# Altium project shm.PrjPcb (part 1 of 2)
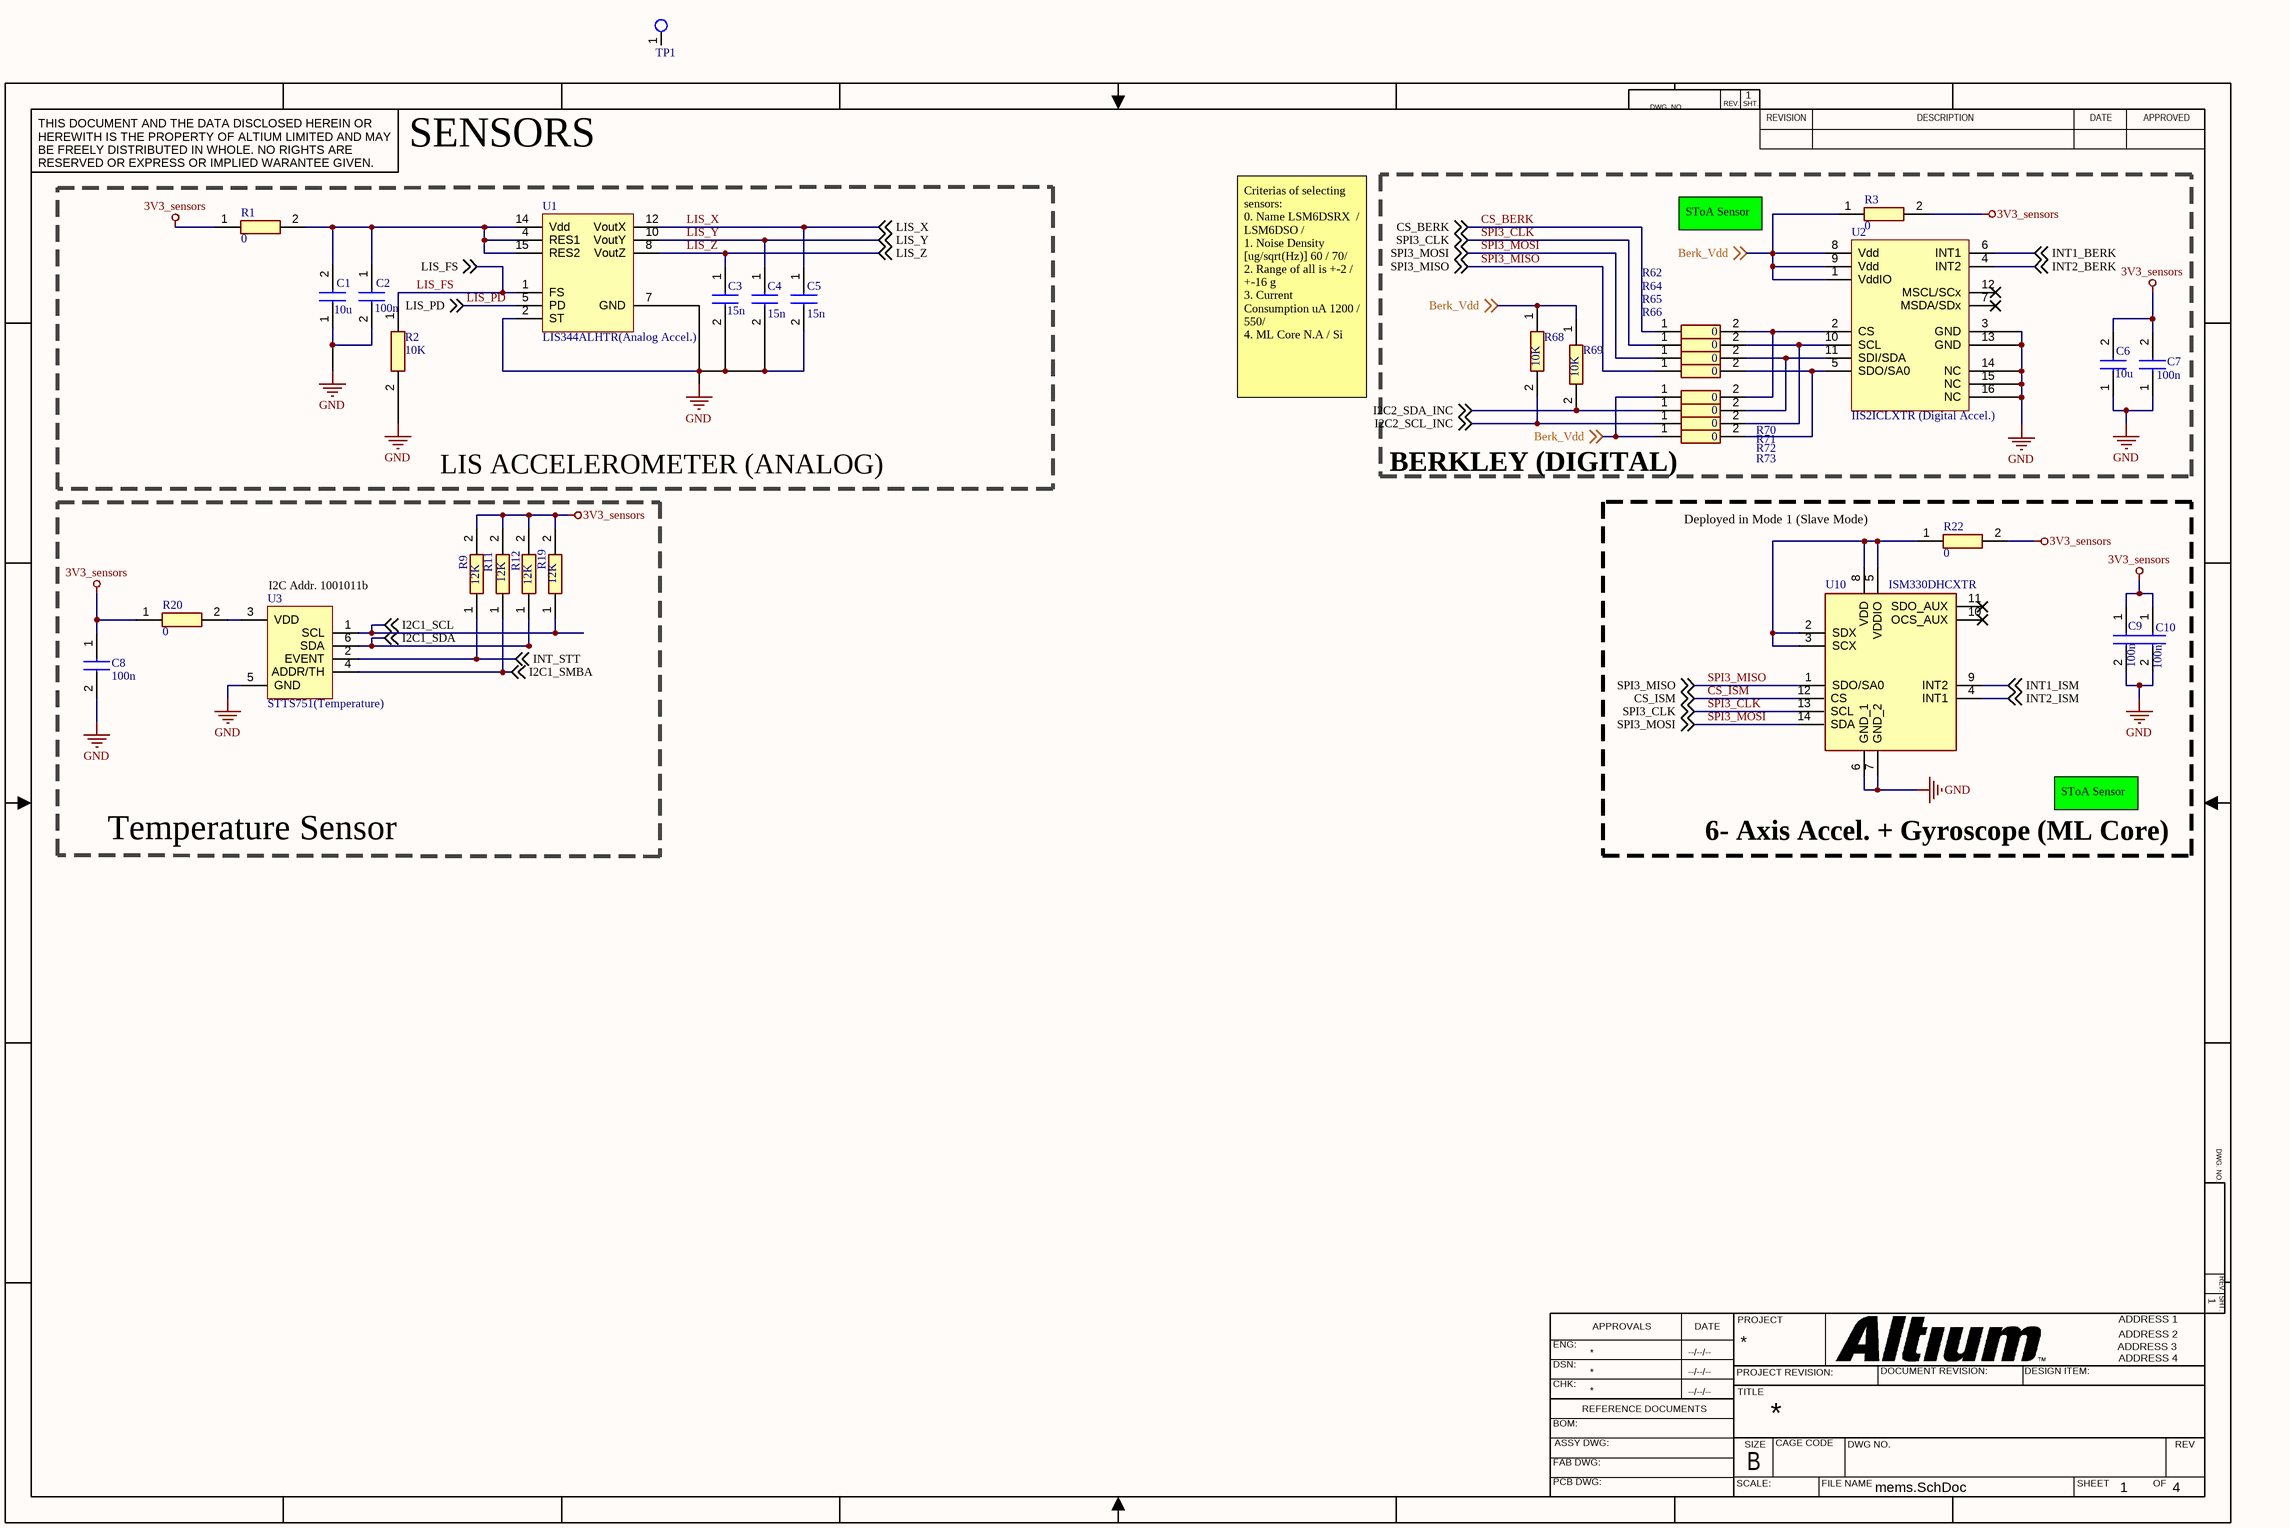
[diagram p0: mems.SchDoc]
4 sheets, 183 parts. Net scope: flat (ports and power ports of the same name join across sheets).
Board file: shm_pcb.PcbDoc
Sheets:
  mems.SchDoc
  connectors.SchDoc
  new power management.SchDoc
  mcu_v1.SchDoc

## Sheet mems.SchDoc
size 431 x 279 mm; Organization: ORGANIZATION; Address1: ADDRESS 1; Address2: ADDRESS 2; Address3: ADDRESS 3; Address4: ADDRESS 4; Revision: -; SheetNumber: 1; SheetTotal: 4; ENG_APP_DATE: --/--/--; DSN_APP_DATE: --/--/--; CHK_APP_DATE: --/--/--

### Parts
C1  10u  [CAPC1608X100N]
C2  100n  [CAPC1608X87N]
C3  15n  [CAPC1608X87N]
C4  15n  [CAPC1608X87N]
C5  15n  [CAPC1608X87N]
C6  10u  [CAPC1608X100N]
C7  100n  [CAPC1608X87N]
C8  100n  [CAPC1608X87N]
C9  100n  [CAPC1608X87N]
C10  100n  [CAPC1608X87N]
R1  0  [RESC1608X55N]
R2  10K  [ERJ3EK_(0603)]
R3  0  [RESC1608X55N]
R9  12K  [RESC0603X26N]
R11  12K  [RESC0603X26N]
R12  12K  [RESC0603X26N]
R19  12K  [RESC0603X26N]
R20  0  [RESC1608X55N]
R22  0  [RESC1608X55N]
R62  0  [RESC1608X55N]
R64  0  [RESC1608X55N]
R65  0  [RESC1608X55N]
R66  0  [RESC1608X55N]
R68  10K  [ERJ3EK_(0603)]
R69  10K  [ERJ3EK_(0603)]
R70  0  [RESC1608X55N]
R71  0  [RESC1608X55N]
R72  0  [RESC1608X55N]
R73  0  [RESC1608X55N]
TP1  test_point  [test_point]  (value not drawn)  (no BOM)
U1  LIS344ALHTR(Analog Accel.)  [LGA16R65P4X4_400X400X160]
U2  IIS2ICLXTR (Digital Accel.)  [Berkley]
U3  STTS751(Temperature)  [SOT95P280X145-6N]
U10  ISM330DHCXTR  [LGA-14(2.5X3X0.86)]

### Blocks framed on the sheet
LIS ACCELEROMETER (ANALOG): C1-C5 R1 R2 U1
BERKLEY (DIGITAL): C6 C7 R3 R62 R64-R66 R68-R73 U2
Temperature Sensor: C8 R9 R11 R12 R19 R20 U3
6- Axis Accel. + Gyroscope (ML Core): C9 C10 R22 U10

### Nets
3V3_sensors: C6.2 C7.2 C8.1 C9.1 C10.1 R1.1 R3.2 R9.2 R11.2 R12.2 R19.2 R20.1 R22.2
GND: C1.1 C2.2 C3.2 C4.2 C5.2 C6.1 C7.1 C8.2 C9.2 C10.2 R2.2 U1.2(ST) U1.7(GND) U2.3(GND) U2.13(GND) U2.14(NC) U2.15(NC) U2.16(NC) U3.5(GND) U10.6(GND_1) U10.7(GND_2)
Berk_Vdd: R3.1 R68.1 R69.1 R70.1 R73.1 U2.1(VddIO) U2.8(Vdd) U2.9(Vdd) ; off-sheet Berk_Vdd
CS_BERK: R62.1 ; off-sheet CS_BERK
CS_ISM: U10.12(CS) ; off-sheet CS_ISM
I2C1_SCL: R19.1 U3.1(SCL) ; off-sheet I2C1_SCL
I2C1_SDA: R12.1 U3.6(SDA) ; off-sheet I2C1_SDA
I2C1_SMBA: R11.1 U3.4(ADDR/TH) ; off-sheet I2C1_SMBA
I2C2_SCL_INC: R68.2 R72.1 ; off-sheet I2C2_SCL_INC
I2C2_SDA_INC: R69.2 R71.1 ; off-sheet I2C2_SDA_INC
INT1_BERK: U2.6(INT1) ; off-sheet INT1_BERK
INT1_ISM: U10.9(INT2) ; off-sheet INT1_ISM
INT2_BERK: U2.4(INT2) ; off-sheet INT2_BERK
INT2_ISM: U10.4(INT1) ; off-sheet INT2_ISM
INT_STT: R9.1 U3.2(EVENT) ; off-sheet INT_STT
LIS_FS: R2.1 U1.1(FS) ; off-sheet LIS_FS
LIS_PD: U1.5(PD) ; off-sheet LIS_PD
LIS_X: C5.1 U1.12(VoutX) ; off-sheet LIS_X
LIS_Y: C4.1 U1.10(VoutY) ; off-sheet LIS_Y
LIS_Z: C3.1 U1.8(VoutZ) ; off-sheet LIS_Z
SPI3_CLK: R64.1 U10.13(SCL) ; off-sheet SPI3_CLK
SPI3_MISO: R66.1 U10.1(SDO/SA0) ; off-sheet SPI3_MISO
SPI3_MOSI: R65.1 U10.14(SDA) ; off-sheet SPI3_MOSI
NetC1_2: C1.2 C2.1 R1.2 U1.4(RES1) U1.14(Vdd) U1.15(RES2)
NetR20_2: R20.2 U3.3(VDD)
NetR22_1: R22.1 U10.2(SDX) U10.3(SCX) U10.5(VDDIO) U10.8(VDD)
NetR62_2: R62.2 R70.2 U2.2(CS)
NetR64_2: R64.2 R72.2 U2.10(SCL)
NetR65_2: R65.2 R71.2 U2.11(SDI/SDA)
NetR66_2: R66.2 R73.2 U2.5(SDO/SA0)

Not connected (* = marked no-connect by the designer): TP1 1(TP); U2 7(MSDA/SDx)* 12(MSCL/SCx)*; U10 10(OCS_AUX)* 11(SDO_AUX)*

### Notes on the sheet
- SENSORS
- SToA Sensor
- Criterias of selecting sensors:
  0. Name LSM6DSRX  / LSM6DSO /
  1. Noise Density [ug/sqrt(Hz)] 60 / 70/
  2. Range of all is +-2 / +-16 g
  3. Current Consumption uA 1200 / 550/
  4. ML Core N.A / Si
- Deployed in Mode 1 (Slave Mode)
- (near U3) I2C Addr. 1001011b
- It is an event detection pin. It will trigger to 0 when temperature is below or equal to low level threshold or higher than an upper boundary.
- This pin has 2 tasks:
  1. Define the address of the I2C slave for the sensor. Sensor's address is based on the pull-up resistor indicated in Table 1 of datasheet. If it is connected to GND, address would be 76h (111 0110b).
  2. Drops to zero when temperature exceeds the THerm limit in register 20h. This pin can either be connected to an MCU (an external interrupt), or to an external Fan to cool down the system.
- DWG. NO.
- REV.
- SHT.
- THIS DOCUMENT AND THE DATA DISCLOSED HEREIN OR HEREWITH IS THE PROPERTY OF ALTIUM LIMITED AND MAY BE FREELY DISTRIBUTED IN WHOLE. NO RIGHTS ARE RESERVED OR EXPRESS OR IMPLIED WARANTEE GIVEN.
- REVISION
- DESCRIPTION
- DATE
- APPROVED
- ENG:
- APPROVALS
- PROJECT
- DSN:
- CHK:
- REFERENCE DOCUMENTS
- PROJECT REVISION:
- TITLE
- DOCUMENT REVISION:
- DESIGN ITEM:
- BOM:
- FAB DWG:
- PCB DWG:
- ASSY DWG:
- SCALE:
- SIZE
- B
- CAGE CODE
- FILE NAME
- DWG NO.
- SHEET
- OF
- REV

### Library data of the parts
C1 C6 = LMK107BBJ106KALT: Capacitor; Manufacturer_Name: TAIYO YUDEN; Datasheet Link: https://componentsearchengine.com//LMK107BBJ106KALT.pdf; Height: 1mm; Mouser2 Part Number: 963-LMK107BBJ106KALT; Mouser2 Price/Stock: https://www.mouser.com/Search/Refine.aspx?Keyword=963-LMK107BBJ106KALT; Manufacturer_Part_Number: LMK107BBJ106KALT
C2 C7-C10 = 885012206071: Capacitor; Manufacturer_Name: Wurth Elektronik; Datasheet Link: https://katalog.we-online.com/pbs/datasheet/885012206071.pdf; Height: 0.87mm; Manufacturer_Part_Number: 885012206071
C3-C5 = 885012206041: Capacitor; Manufacturer_Name: Wurth Elektronik; Datasheet Link: https://katalog.we-online.com/pbs/datasheet/885012206041.pdf; Height: 0.87mm; Manufacturer_Part_Number: 885012206041
R1 R3 R20 R22 R62 R64-R66 R70-R73 = RC0603FR-070RL: Resistor; Manufacturer_Name: YAGEO (PHYCOMP); Height: 0.55mm; Manufacturer_Part_Number: RC0603FR-070RL
R2 R68 R69 = ERJ-3EKF1002V: Resistor; Manufacturer_Name: Panasonic; Datasheet Link: https://componentsearchengine.com//ERJ-3EKF1002V.pdf; Height: 0.55mm; Mouser2 Part Number: 667-ERJ-3EKF1002V; Mouser2 Price/Stock: https://www.mouser.com/Search/Refine.aspx?Keyword=667-ERJ-3EKF1002V; Manufacturer_Part_Number: ERJ-3EKF1002V
R9 R11 R12 R19 = ERJ-1RHD1202C: Resistor; Manufacturer_Name: Panasonic; Datasheet Link: https://industrial.panasonic.com/cdbs/www-data/pdf/RDA0000/AOA0000C304.pdf; Height: 0.26mm; Manufacturer_Part_Number: ERJ-1RHD1202C
U1 = LIS344ALHTR: 3-axis analog accelerometer, ±2 g / ±6 g user selectable full-scale, ultra compact, low power; Manufacturer: STMicroelectronics; Max Supply Voltage: 3.6V; Min Supply Voltage: 2.4V; Nominal Supply Current: 680uA; Bandwidth: 2kHz; Sensitivity: 15000mV/g; Axis: X, Y, Z; Supplier 1: Digi-Key; Manufacturer Part Number: LIS344ALHTR; RoHS: Yes; Stock 1: 153; Mount: Surface Mount; Case/Package: LGA; Number of Pins: 16; Contact Plating: Gold; Min Operating Temperature: -40°C; Max Operating Temperature: 85°C; Packaging: Tape and Reel; Package Quantity: 1; Output Type: Analog; Length: 4.15mm; Width: 4.15mm; Height: 1.33mm; Radiation Hardening: No; Lead Free: Lead Free; ComponentLink1URL: https://datasheet.ciiva.com/12174/cd00182781-85334-12174772.pdf?src-supplier=Mouser; ComponentLink1Description: https://datasheet.ciiva.com/12174/cd00182781-85334-12174772.pdf?src-supplier=Mouser; ComponentLink2URL: https://datasheet.ciiva.com/26928/lis344alhtr-26928753.pdf?src-supplier=IIIC; ComponentLink2Description: https://datasheet.ciiva.com/26928/lis344alhtr-26928753.pdf?src-supplier=IIIC; ComponentLink3URL: https://datasheet.ciiva.com/2809/cd00182781-2809847.pdf?src-supplier=Digi-Key; ComponentLink3Description: https://datasheet.ciiva.com/2809/cd00182781-2809847.pdf?src-supplier=Digi-Key; ComponentLink4URL: https://datasheet.ciiva.com/16372/cd00182781-16372423.pdf?src-supplier=Future+Electronics; ComponentLink4Description: https://datasheet.ciiva.com/16372/cd00182781-16372423.pdf?src-supplier=Future+Electronics; ComponentLink5URL: https://datasheet.ciiva.com/2809/cd00182781-2809848.pdf?src-supplier=Digi-Key; ComponentLink5Description: https://datasheet.ciiva.com/2809/cd00182781-2809848.pdf?src-supplier=Digi-Key; ComponentLink6URL: https://datasheet.ciiva.com/2809/cd00182781-2809849.pdf?src-supplier=Digi-Key; ComponentLink6Description: https://datasheet.ciiva.com/2809/cd00182781-2809849.pdf?src-supplier=Digi-Key; ComponentLink7URL: https://datasheet.ciiva.com/16638/cd00182781-16638187.pdf?src-supplier=Avnet+Europe; ComponentLink7Description: https://datasheet.ciiva.com/16638/cd00182781-16638187.pdf?src-supplier=Avnet+Europe; Supplier Part Number 1: 497-6345-1-ND; Category: Sensors
U2 = IIS2ICLXTR: High-accuracy, high-resolution, low-power, 2- axis digital inclinometer; Manufacturer: STMicroelectronics; Supplier 1: Digi-Key; Supplier Part Number 1: 497-IIS2ICLXCT-ND; Manufacturer Part Number: IIS2ICLXTR; RoHS: Yes; Category: Accelerometers; Stock 1: 25
U3 = STTS751-1DP3F: SENSOR TEMPERATURE SMBUS 6UDFN; Manufacturer: STMicroelectronics; Interface: I2C,SMBus,2-Wire,Serial; Resolution: 12b; Output Type: Digital; Max Output Current: 20mA; Min Supply Voltage: 2.25V; Max Supply Voltage: 3.6V; Min Supply Voltage (DC): 2V; Operating Supply Current: 50uA; Supplier 1: RSComponents; Supplier Part Number 1: 1908454; Manufacturer Part Number: STTS751-1DP3F; RoHS: Yes; Category: Sensors; Stock 1: 1; Mount: Surface Mount; Number of Pins: 6; Min Operating Temperature: -40°C; Max Operating Temperature: 125°C; Package Quantity: 3000; Packaging: Tape and Reel; Output Current: 20mA; Max Supply Voltage (DC): 3.6V; Series: STTS751; Radiation Hardening: No; Lead Free: Lead Free; RoHS Compliant: Yes; ComponentLink1URL: https://datasheet.ciiva.com/5299/cd00252523-68863-5299731.pdf?src-supplier=Mouser; ComponentLink1Description: https://datasheet.ciiva.com/5299/cd00252523-68863-5299731.pdf?src-supplier=Mouser; ComponentLink2URL: https://datasheet.ciiva.com/2003/cd00252523-2003053.pdf?src-supplier=Digi-Key; ComponentLink2Description: https://datasheet.ciiva.com/2003/cd00252523-2003053.pdf?src-supplier=Digi-Key; ComponentLink3URL: https://datasheet.ciiva.com/2003/cd00252523-2003054.pdf?src-supplier=Digi-Key; ComponentLink3Description: https://datasheet.ciiva.com/2003/cd00252523-2003054.pdf?src-supplier=Digi-Key; ComponentLink4URL: https://datasheet.ciiva.com/16635/cd00252523-16635462.pdf?src-supplier=Avnet+Europe; ComponentLink4Description: https://datasheet.ciiva.com/16635/cd00252523-16635462.pdf?src-supplier=Avnet+Europe; ComponentLink5URL: https://datasheet.ciiva.com/2003/cd00252523-2003052.pdf?src-supplier=Digi-Key; ComponentLink5Description: https://datasheet.ciiva.com/2003/cd00252523-2003052.pdf?src-supplier=Digi-Key
U10 = ISM330DHCXTR: iNEMO inertial Sensor include 3D accelerometer & 3D gyroscope; LGA-14L package; Manufacturer: STMicroelectronics; Supplier 1: Digi-Key; Supplier Part Number 1: 497-19784-1-ND; Manufacturer Part Number: ISM330DHCXTR; RoHS: Yes; Category: Inertial Measurement Units (IMUs); Stock 1: 9794

## Sheet connectors.SchDoc
size 431 x 279 mm; SheetNumber: 2; SheetTotal: 4
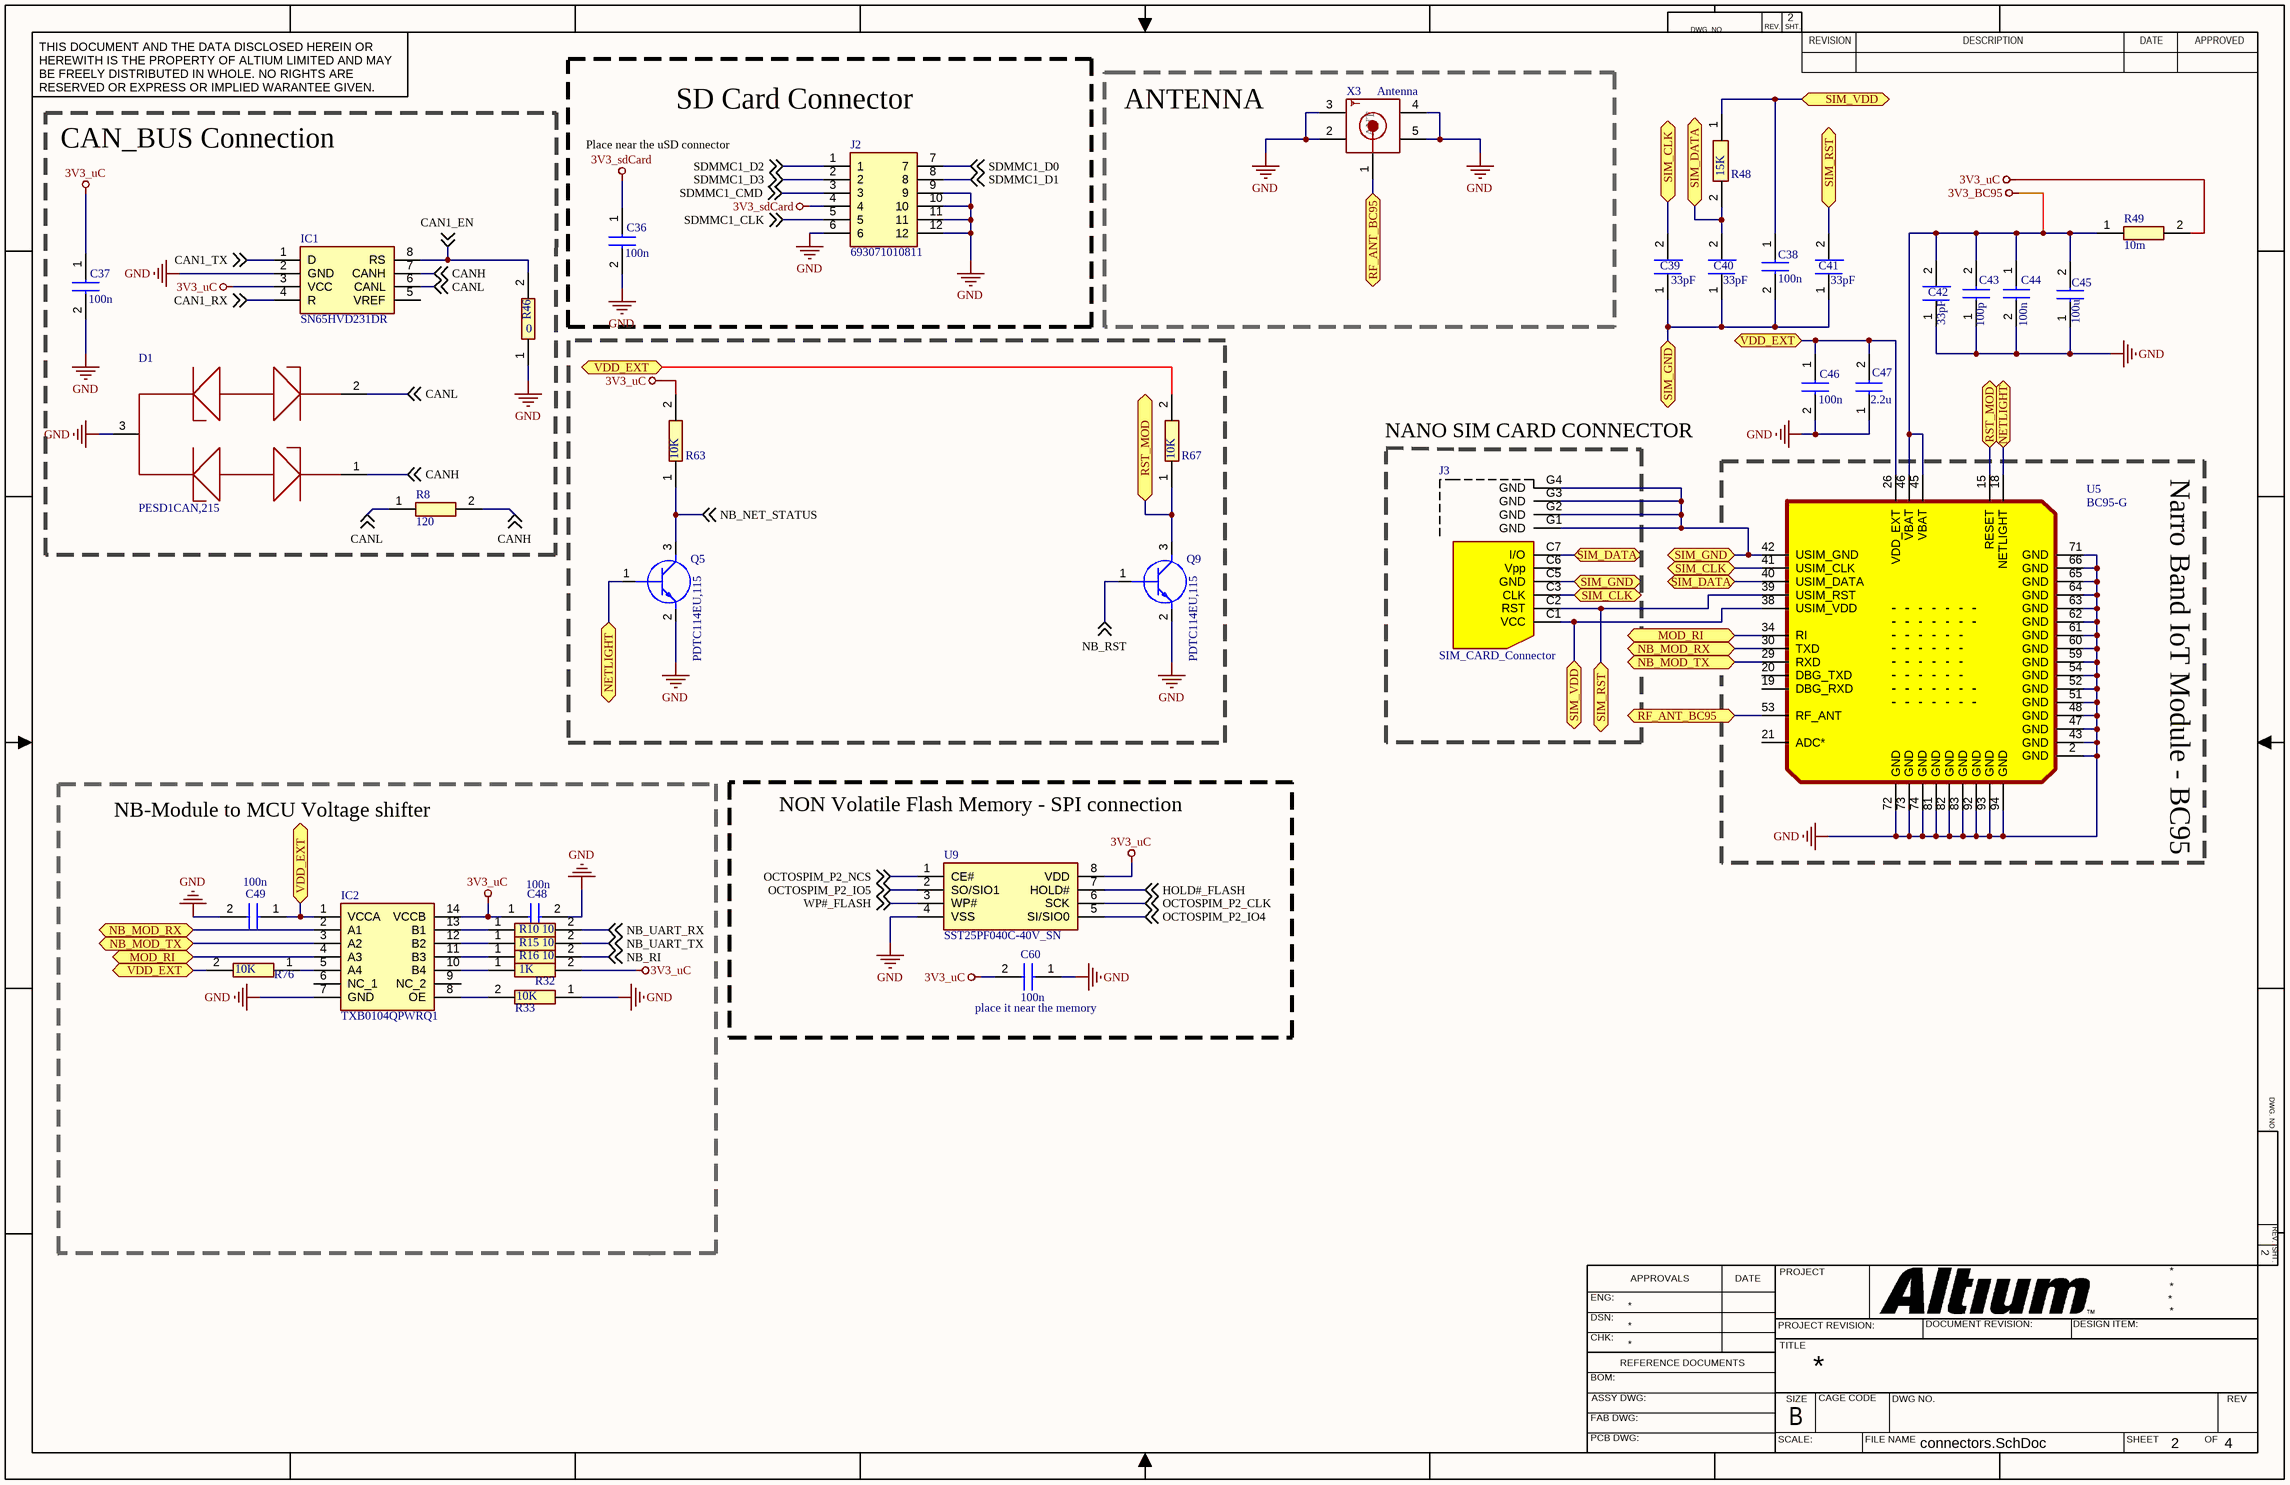
[diagram p1: connectors.SchDoc]

### Parts
C36  100n  [CAPC1608X87N]
C37  100n  [CAPC1608X87N]
C38  100n  [CAPC1608X87N]
C39  33pF  [CAPC1608X87N]
C40  33pF  [CAPC1608X87N]
C41  33pF  [CAPC1608X87N]
C42  33pF  [CAPC1608X87N]
C43  100p  [CAPC1608X87N]
C44  100n  [CAPC1608X87N]
C45  100u  [CAPC3216X180N]
C46  100n  [CAPC1608X87N]
C47  2.2u  [CAPC1608X50N]
C48  100n  [CAPC1608X87N]
C49  100n  [CAPC1608X87N]
C60  100n  [CAPC1608X87N]
D1  PESD1CAN,215  [SOT95P230X110-3N]
IC1  SN65HVD231DR  [SOIC127P600X175-8N]
IC2  TXB0104QPWRQ1  [SOP65P640X120-14N]
J2  693071010811  [693071010811]
J3  SIM_CARD_Connector  [SIM8060601400A]
Q5  PDTC114EU,115  [SOT65P210X110-3N]
Q9  PDTC114EU,115  [SOT65P210X110-3N]
R8  120  [ERA2V_(0402)]
R10  10  [RESC1005X40N]
R15  10  [RESC1005X40N]
R16  10  [RESC1005X40N]
R32  1K  [RESC1608X55N]
R33  10K  [ERJ3EK_(0603)]
R46  0  [RESC1608X55N]
R48  15K  [RESC1508X50N]
R49  10m  [ERJ6_B_BW_R_LW_CW_D]
R63  10K  [ERJ3EK_(0603)]
R67  10K  [ERJ3EK_(0603)]
R76  10K  [ERJ3EK_(0603)]
U5  BC95-G  [XCVR_BC95GJB02STD]
U9  SST25PF040C-40V_SN  [SOIC127P600X175-8N]
X3  Antenna  [PCBSMAFRAHT]

### Blocks framed on the sheet
CAN_BUS Connection: C37 D1 IC1 R8 R46
SD Card Connector: C36 J2
ANTENNA: X3
NB-Module to MCU Voltage shifter: C48 C49 IC2 R10 R15 R16 R32 R33 R76
NON Volatile Flash Memory - SPI connection: C60 U9

### Ports
MOD_RI (bidir), NB_MOD_RX (bidir), NB_MOD_TX (bidir), NETLIGHT (bidir), RF_ANT_BC95 (bidir), RST_MOD (bidir), SIM_CLK (bidir), SIM_DATA (bidir), SIM_GND (bidir), SIM_RST (bidir), SIM_VDD (bidir), VDD_EXT (bidir)

### Nets
3V3_BC95: C42.2 C43.2 C44.1 C45.2 R49.1 U5.45(VBAT) U5.46(VBAT)
3V3_sdCard: C36.1 J2.4
3V3_uC: C37.1 C48.1 C60.2 IC1.3(VCC) IC2.14(VCCB) R32.2 R49.2 R63.2 U9.8(VDD)
GND: C36.2 C37.2 C42.1 C43.1 C44.2 C45.1 C46.2 C47.1 C48.2 C49.2 C60.1 D1.3 IC1.2(GND) IC2.7(GND) J2.6 J2.9 J2.10 J2.11 J2.12 Q5.2(E) Q9.2(E) R33.1 R46.1 U5.2(GND) U5.43(GND) U5.47(GND) U5.48(GND) U5.51(GND) U5.52(GND) U5.54(GND) U5.59(GND) U5.60(GND) U5.61(GND) U5.62(GND) U5.63(GND) U5.64(GND) U5.65(GND) U5.66(GND) U5.71(GND) U5.72(GND) U5.73(GND) U5.74(GND) U5.81(GND) U5.82(GND) U5.83(GND) U5.92(GND) U5.93(GND) U5.94(GND) U9.4(VSS) X3.2 X3.3 X3.4 X3.5
CAN1_EN: IC1.8(RS) R46.2 ; off-sheet CAN1_EN
CAN1_RX: IC1.4(R) ; off-sheet CAN1_RX
CAN1_TX: IC1.1(D) ; off-sheet CAN1_TX
CANH: D1.1 IC1.7(CANH) R8.2 ; off-sheet CANH
CANL: D1.2 IC1.6(CANL) R8.1 ; off-sheet CANL
HOLD#_FLASH: U9.7(HOLD#) ; off-sheet HOLD#_FLASH
NB_NET_STATUS: Q5.3(C) R63.1 ; off-sheet NB_NET_STATUS
NB_RI: R16.2 ; off-sheet NB_RI
NB_RST: Q9.1(B) ; off-sheet NB_RST
NB_UART_RX: R10.2 ; off-sheet NB_UART_RX
NB_UART_TX: R15.2 ; off-sheet NB_UART_TX
OCTOSPIM_P2_CLK: U9.6(SCK) ; off-sheet OCTOSPIM_P2_CLK
OCTOSPIM_P2_IO4: U9.5(SI/SIO0) ; off-sheet OCTOSPIM_P2_IO4
OCTOSPIM_P2_IO5: U9.2(SO/SIO1) ; off-sheet OCTOSPIM_P2_IO5
OCTOSPIM_P2_NCS: U9.1(CE#) ; off-sheet OCTOSPIM_P2_NCS
SDMMC1_CLK: J2.5 ; off-sheet SDMMC1_CLK
SDMMC1_CMD: J2.3 ; off-sheet SDMMC1_CMD
SDMMC1_D0: J2.7 ; off-sheet SDMMC1_D0
SDMMC1_D1: J2.8 ; off-sheet SDMMC1_D1
SDMMC1_D2: J2.1 ; off-sheet SDMMC1_D2
SDMMC1_D3: J2.2 ; off-sheet SDMMC1_D3
WP#_FLASH: U9.3(WP#) ; off-sheet WP#_FLASH
NetC38_1: C38.1 J3.C1(VCC) R48.1 U5.38(USIM_VDD) ; port SIM_VDD
NetC38_2: C38.2 C39.1 C40.1 C41.1 J3.C5(GND) J3.G1(GND) J3.G2(GND) J3.G3(GND) J3.G4(GND) U5.42(USIM_GND) ; port SIM_GND
NetC39_2: C39.2 J3.C3(CLK) U5.41(USIM_CLK) ; port SIM_CLK
NetC40_2: C40.2 J3.C7(I/O) R48.2 U5.40(USIM_DATA) ; port SIM_DATA
NetC41_2: C41.2 J3.C2(RST) U5.39(USIM_RST) ; port SIM_RST
NetC46_1: C46.1 C47.2 C49.1 IC2.1(VCCA) R67.2 R76.2 U5.26(VDD_EXT) ; port VDD_EXT
NetIC2_2: IC2.2(A1) U5.30(TXD) ; port NB_MOD_RX
NetIC2_3: IC2.3(A2) U5.29(RXD) ; port NB_MOD_TX
NetIC2_4: IC2.4(A3) U5.34(RI) ; port MOD_RI
NetIC2_5: IC2.5(A4) R76.1
NetIC2_8: IC2.8(OE) R33.2
NetIC2_10: IC2.10(B4) R32.1
NetIC2_11: IC2.11(B3) R16.1
NetIC2_12: IC2.12(B2) R15.1
NetIC2_13: IC2.13(B1) R10.1
NetQ5_1: Q5.1(B) U5.18(NETLIGHT) ; port NETLIGHT
NetQ9_3: Q9.3(C) R67.1 U5.15(RESET) ; port RST_MOD
NetU5_53: U5.53(RF_ANT) X3.1 ; port RF_ANT_BC95

Not connected (* = marked no-connect by the designer): IC1 5(VREF); IC2 6(NC_1) 9(NC_2); J3 C6(Vpp); U5 1(RESERVED) 3(RESERVED) 4(RESERVED) 5(RESERVED) 6(RESERVED) 7(RESERVED) 8(RESERVED) 9(RESERVED) 10(RESERVED) 11(RESERVED) 12(RESERVED) 13(RESERVED) 14(RESERVED) 16(RESERVED) 17(RESERVED) 19(DBG_RXD) 20(DBG_TXD) 21(ADC*) 22(RESERVED) 23(RESERVED) 24(RESERVED) 25(RESERVED) 27(RESERVED) 28(RESERVED) 31(RESERVED) 32(RESERVED) 33(RESERVED) 35(RESERVED) 36(RESERVED) 37(RESERVED) 44(RESERVED) 49(RESERVED) 50(RESERVED) 55(RESERVED) 56(RESERVED) 57(RESERVED) 58(RESERVED) 67(RESERVED) 68(RESERVED) 69(RESERVED) 70(RESERVED) 75(RESERVED) 76(RESERVED) 77(RESERVED) 78(RESERVED) 79(RESERVED) 80(RESERVED) 84(RESERVED) 85(RESERVED) 86(RESERVED) 87(RESERVED) 88(RESERVED) 89(RESERVED) 90(RESERVED) 91(RESERVED)

### Notes on the sheet
- Place near the uSD connector
- (near J3) NANO SIM CARD CONNECTOR
- Narro Band IoT Module - BC95
- (near C60) place it near the memory
- DWG. NO.
- REV.
- SHT.
- THIS DOCUMENT AND THE DATA DISCLOSED HEREIN OR HEREWITH IS THE PROPERTY OF ALTIUM LIMITED AND MAY BE FREELY DISTRIBUTED IN WHOLE. NO RIGHTS ARE RESERVED OR EXPRESS OR IMPLIED WARANTEE GIVEN.
- REVISION
- DESCRIPTION
- DATE
- APPROVED
- ENG:
- APPROVALS
- PROJECT
- DSN:
- CHK:
- REFERENCE DOCUMENTS
- PROJECT REVISION:
- TITLE
- DOCUMENT REVISION:
- DESIGN ITEM:
- BOM:
- FAB DWG:
- PCB DWG:
- ASSY DWG:
- SCALE:
- SIZE
- B
- CAGE CODE
- FILE NAME
- DWG NO.
- SHEET
- OF
- REV
- (in symbol PCB.SMAFRA.HT) ANT

### Library data of the parts
C36-C38 C44 C46 C48 C49 C60 = 885012206071: as C2 on sheet mems; Datasheet Link: https://katalog.we-online.com/pbs/datasheet/885012206071.pdf; Height: 0.87mm; Manufacturer_Part_Number: 885012206071
C39-C42 = VJ0603A330KXXCW1BC: Cap Ceramic 33pF 25V C0G 10% SMD 0603 125°C Paper T/R; Manufacturer: Vishay Vitramon; Dielectric Material: Tantalum; Supplier 1: Mouser; Supplier Part Number 1: 77-VJ0603A330KXXCBC; Manufacturer Part Number: VJ0603A330KXXCW1BC; RoHS: Yes; Category: Ceramic Capacitors; Stock 1: 1121; Mount: Surface Mount; Case/Package: 0603; Case Code (Imperial): 0603; Case Code (Metric): 1608; Min Operating Temperature: -55°C; Max Operating Temperature: 125°C; Capacitance: 33pF; Tolerance: 10%; Package Quantity: 4000; Packaging: Tape and Reel; Dielectric: C0G; Voltage Rating (DC): 25V; Termination: SMD/SMT; Series: VJ W1BC; Construction: Flat; Length: 1.6mm; Width: 0.8mm; Height: 0.95mm; Depth: 0.8mm; Lead Free: Lead Free; RoHS Compliant: Yes; ComponentLink1URL: http://www.mouser.com/ds/2/427/vjw1bcbascomseries-223529.pdf?src-supplier=Mouser; ComponentLink1Description: http://www.mouser.com/ds/2/427/vjw1bcbascomseries-223529.pdf?src-supplier=Mouser; ComponentLink2URL: http://www.vishay.com/docs/28548/vjw1bcbascomseries.pdf?src-supplier=Avnet; ComponentLink2Description: http://www.vishay.com/docs/28548/vjw1bcbascomseries.pdf?src-supplier=Avnet; ComponentLink3URL: https://www.vishay.com/docs/28548/vjw1bcbascomseries.pdf?src-supplier=Digi-Key; ComponentLink3Description: https://www.vishay.com/docs/28548/vjw1bcbascomseries.pdf?src-supplier=Digi-Key
C43 = 885012206003: Capacitor; Manufacturer_Name: Wurth Elektronik; Datasheet Link: https://katalog.we-online.com/pbs/datasheet/885012206003.pdf; Height: 0.87mm; Manufacturer_Part_Number: 885012206003
C45 = GRM31CR60J107ME39L: Capacitor; Manufacturer_Name: Murata Electronics; Datasheet Link: https://componentsearchengine.com//GRM31CR60J107ME39L.pdf; Height: 1.8mm; Mouser2 Part Number: 81-GRM31CR60J107ME9L; Mouser2 Price/Stock: https://www.mouser.com/Search/Refine.aspx?Keyword=81-GRM31CR60J107ME9L; Manufacturer_Part_Number: GRM31CR60J107ME39L
C47 = EMK107BJ225KA-T: Capacitor; Manufacturer_Name: TAIYO YUDEN; Height: 0.5mm; Manufacturer_Part_Number: EMK107BJ225KA-T
D1 = PESD1CAN,215: ESD Suppressor Diode TVS Bi-Dir 24V Automotive 3-Pin SOT-23 T/R / TVS DIODE 24VWM 70VC SOT23; Manufacturer: Nexperia; Supplier 1: RSComponents; Supplier Part Number 1: 1242373; Manufacturer Part Number: PESD1CAN,215; RoHS: Yes; Category: ESD and Circuit Protection ICs; Stock 1: 129000; ComponentLink1URL: http://www.farnell.com/datasheets/109497.pdf?src-supplier=Farnell; ComponentLink1Description: http://www.farnell.com/datasheets/109497.pdf?src-supplier=Farnell; ComponentLink2URL: https://assets.nexperia.com/documents/data-sheet/PESD1CAN.pdf?src-supplier=Digi-Key; ComponentLink2Description: https://assets.nexperia.com/documents/data-sheet/PESD1CAN.pdf?src-supplier=Digi-Key; ComponentLink3URL: http://www.farnell.com/datasheets/109497.pdf?src-supplier=Newark; ComponentLink3Description: http://www.farnell.com/datasheets/109497.pdf?src-supplier=Newark
IC1 = SN65HVD231DR: Integrated Circuit; Manufacturer_Name: Texas Instruments; Datasheet Link: http://www.ti.com/lit/gpn/sn65hvd231; Height: 1.75mm; Manufacturer_Part_Number: SN65HVD231DR
IC2 = TXB0104QPWRQ1: Integrated Circuit; Manufacturer_Name: Texas Instruments; Datasheet Link: http://www.ti.com/lit/gpn/txb0104-q1; Height: 1.2mm; Mouser2 Part Number: 595-TXB0104QPWRQ1; Mouser2 Price/Stock: https://www.mouser.com/Search/Refine.aspx?Keyword=595-TXB0104QPWRQ1; Manufacturer_Part_Number: TXB0104QPWRQ1
J2 = 693071010811: Connector; Manufacturer_Name: Wurth Elektronik; Datasheet Link: https://www.we-online.de/katalog/datasheet/693071010811.pdf; Height: 2.13mm; Manufacturer_Part_Number: 693071010811
J3 = SIM8060-6-0-14-00-A: Sim Nano Hinged, 6P, 1.40MM Prof; Manufacturer: GCT; Supplier 1: Digi-Key; Supplier Part Number 1: 2073-SIM8060-6-0-14-00-ACT-ND; Manufacturer Part Number: SIM8060-6-0-14-00-A
Q5 Q9 = PDTC114EU,115: Transistor BJT NPN; Manufacturer_Name: Nexperia; Datasheet Link: https://componentsearchengine.com//PDTC114EU,115.pdf; Height: 1.1mm; Mouser2 Part Number: 771-PDTC114EU115; Mouser2 Price/Stock: https://www.mouser.com/Search/Refine.aspx?Keyword=771-PDTC114EU115; Manufacturer_Part_Number: PDTC114EU,115
R8 = ERA-2VEB1200X: Resistor; Manufacturer_Name: Panasonic; Datasheet Link: http://industrial.panasonic.com/cdbs/www-data/pdf/RDM0000/RDM0000C331.pdf; Height: 0.4mm; Manufacturer_Part_Number: ERA-2VEB1200X
R10 R15 R16 = CR0402-FX-10R0GLF: Resistor; Manufacturer_Name: Bourns; Datasheet Link: https://www.bourns.com/pdfs/CR0402.pdf; Height: 0.4mm; Manufacturer_Part_Number: CR0402-FX-10R0GLF
R32 = CRCW06031K00FKEAC: Resistor; Manufacturer_Name: Vishay; Datasheet Link: https://componentsearchengine.com//CRCW06031K00FKEAC.pdf; Height: 0.55mm; Mouser2 Part Number: 71-CRCW06031K00FKEAC; Mouser2 Price/Stock: https://www.mouser.com/Search/Refine.aspx?Keyword=71-CRCW06031K00FKEAC; Manufacturer_Part_Number: CRCW06031K00FKEAC
R33 R63 R67 R76 = ERJ-3EKF1002V: Resistor; Manufacturer_Name: Panasonic; Datasheet Link: https://componentsearchengine.com//ERJ-3EKF1002V.pdf; Height: 0.55mm; Mouser2 Part Number: 667-ERJ-3EKF1002V; Mouser2 Price/Stock: https://www.mouser.com/Search/Refine.aspx?Keyword=667-ERJ-3EKF1002V; Manufacturer_Part_Number: ERJ-3EKF1002V
R46 = RC0603FR-070RL: as R1 on sheet mems; Height: 0.55mm; Manufacturer_Part_Number: RC0603FR-070RL
R48 = RCS060315K0FKEA: Res Thick Film 0603 15K Ohm 1% 0.25W(1/4W) ±100ppm/°C Pad SMD Automotive Medical T/R; Manufacturer: Vishay Dale; Max Power Dissipation: 250mW; Resistance: 15kR; Supplier 1: Digi-Key; Supplier Part Number 1: 541-2796-1-ND; Manufacturer Part Number: RCS060315K0FKEA; RoHS: Yes; Category: Chip SMD Resistors; Stock 1: 3973; Case/Package: 0603; Case Code (Imperial): 0603; Case Code (Metric): 1608; Min Operating Temperature: -55°C; Max Operating Temperature: 155°C; Tolerance: 1%; Temperature Coefficient: 100ppm/°C; Packaging: Tape and Reel; Resistor Type: Thick Film; Number of Terminations: 2; Features: Automotive AEC-Q200; Length: 0.061inch; Width: 0.033inch; Height: 0.02inch; ComponentLink1URL: http://www.vishay.com/docs/20065/rcse3.pdf?src-supplier=Digi-Key; ComponentLink1Description: http://www.vishay.com/docs/20065/rcse3.pdf?src-supplier=Digi-Key
R49 = ERJ-6CWDR010V: Resistor; Manufacturer_Name: Panasonic; Datasheet Link: https://componentsearchengine.com//ERJ-6CWDR010V.pdf; Mouser2 Part Number: 667-ERJ-6CWDR010V; Mouser2 Price/Stock: https://www.mouser.com/Search/Refine.aspx?Keyword=667-ERJ-6CWDR010V; Manufacturer_Part_Number: ERJ-6CWDR010V
U5 = MIKROE-3294: NB IoT Click BC95 LTE CAT NB1 Module Add-On Board; Manufacturer: mikroElektronika; Supplier 1: RSComponents; Supplier Part Number 1: 1840145; Manufacturer Part Number: MIKROE-3294; RoHS: No; Stock 1: 1
U9 = SST25PF040C-40V_SN: Integrated Circuit; Manufacturer_Name: Microchip; Manufacturer_Part_Number: SST25PF040C-40V/SN; Datasheet Link: https://componentsearchengine.com/Datasheets/1/SST25PF040C-40V_SN.pdf; Height: 1.75mm
X3 = PCB.SMAFRA.HT: CONNSMAJACKR/A50OHMPCB; Manufacturer: Taoglas; Body Material: Brass; Dielectric Material: PTFE; Body Plating: Gold; Connector Type: SMA,Socket; Max Frequency: 6GHz; Voltage Rating: 500V; Impedance: 50R; Supplier 1: Digi-Key; Supplier Part Number 1: 931-1361-ND; Manufacturer Part Number: PCB.SMAFRA.HT; RoHS: Yes; Category: RF / Coaxial Connectors; Stock 1: 9426; Mount: Through Hole,Surface Mount; Case/Package: SMA; Contact Plating: Gold; Contact Material: Brass; Housing Color: Gold; Package Quantity: 500; Packaging: Tray; Termination: Solder; Fastening Type: Threaded; Frequency: 6GHz; Orientation: Right Angle; ComponentLink1URL: http://taoglas.com/images/product_images/original_images/PCB.SMAFRA.HT.pdf?src-supplier=Avnet; ComponentLink1Description: http://taoglas.com/images/product_images/original_images/PCB.SMAFRA.HT.pdf?src-supplier=Avnet; ComponentLink2URL: http://www.taoglas.com/wp-content/uploads/2016/01/PCB.SMAFRA.HT_.pdf?src-supplier=Digi-Key; ComponentLink2Description: http://www.taoglas.com/wp-content/uploads/2016/01/PCB.SMAFRA.HT_.pdf?src-supplier=Digi-Key

## Sheet new power management.SchDoc
size 431 x 279 mm; SheetNumber: 3; SheetTotal: 4
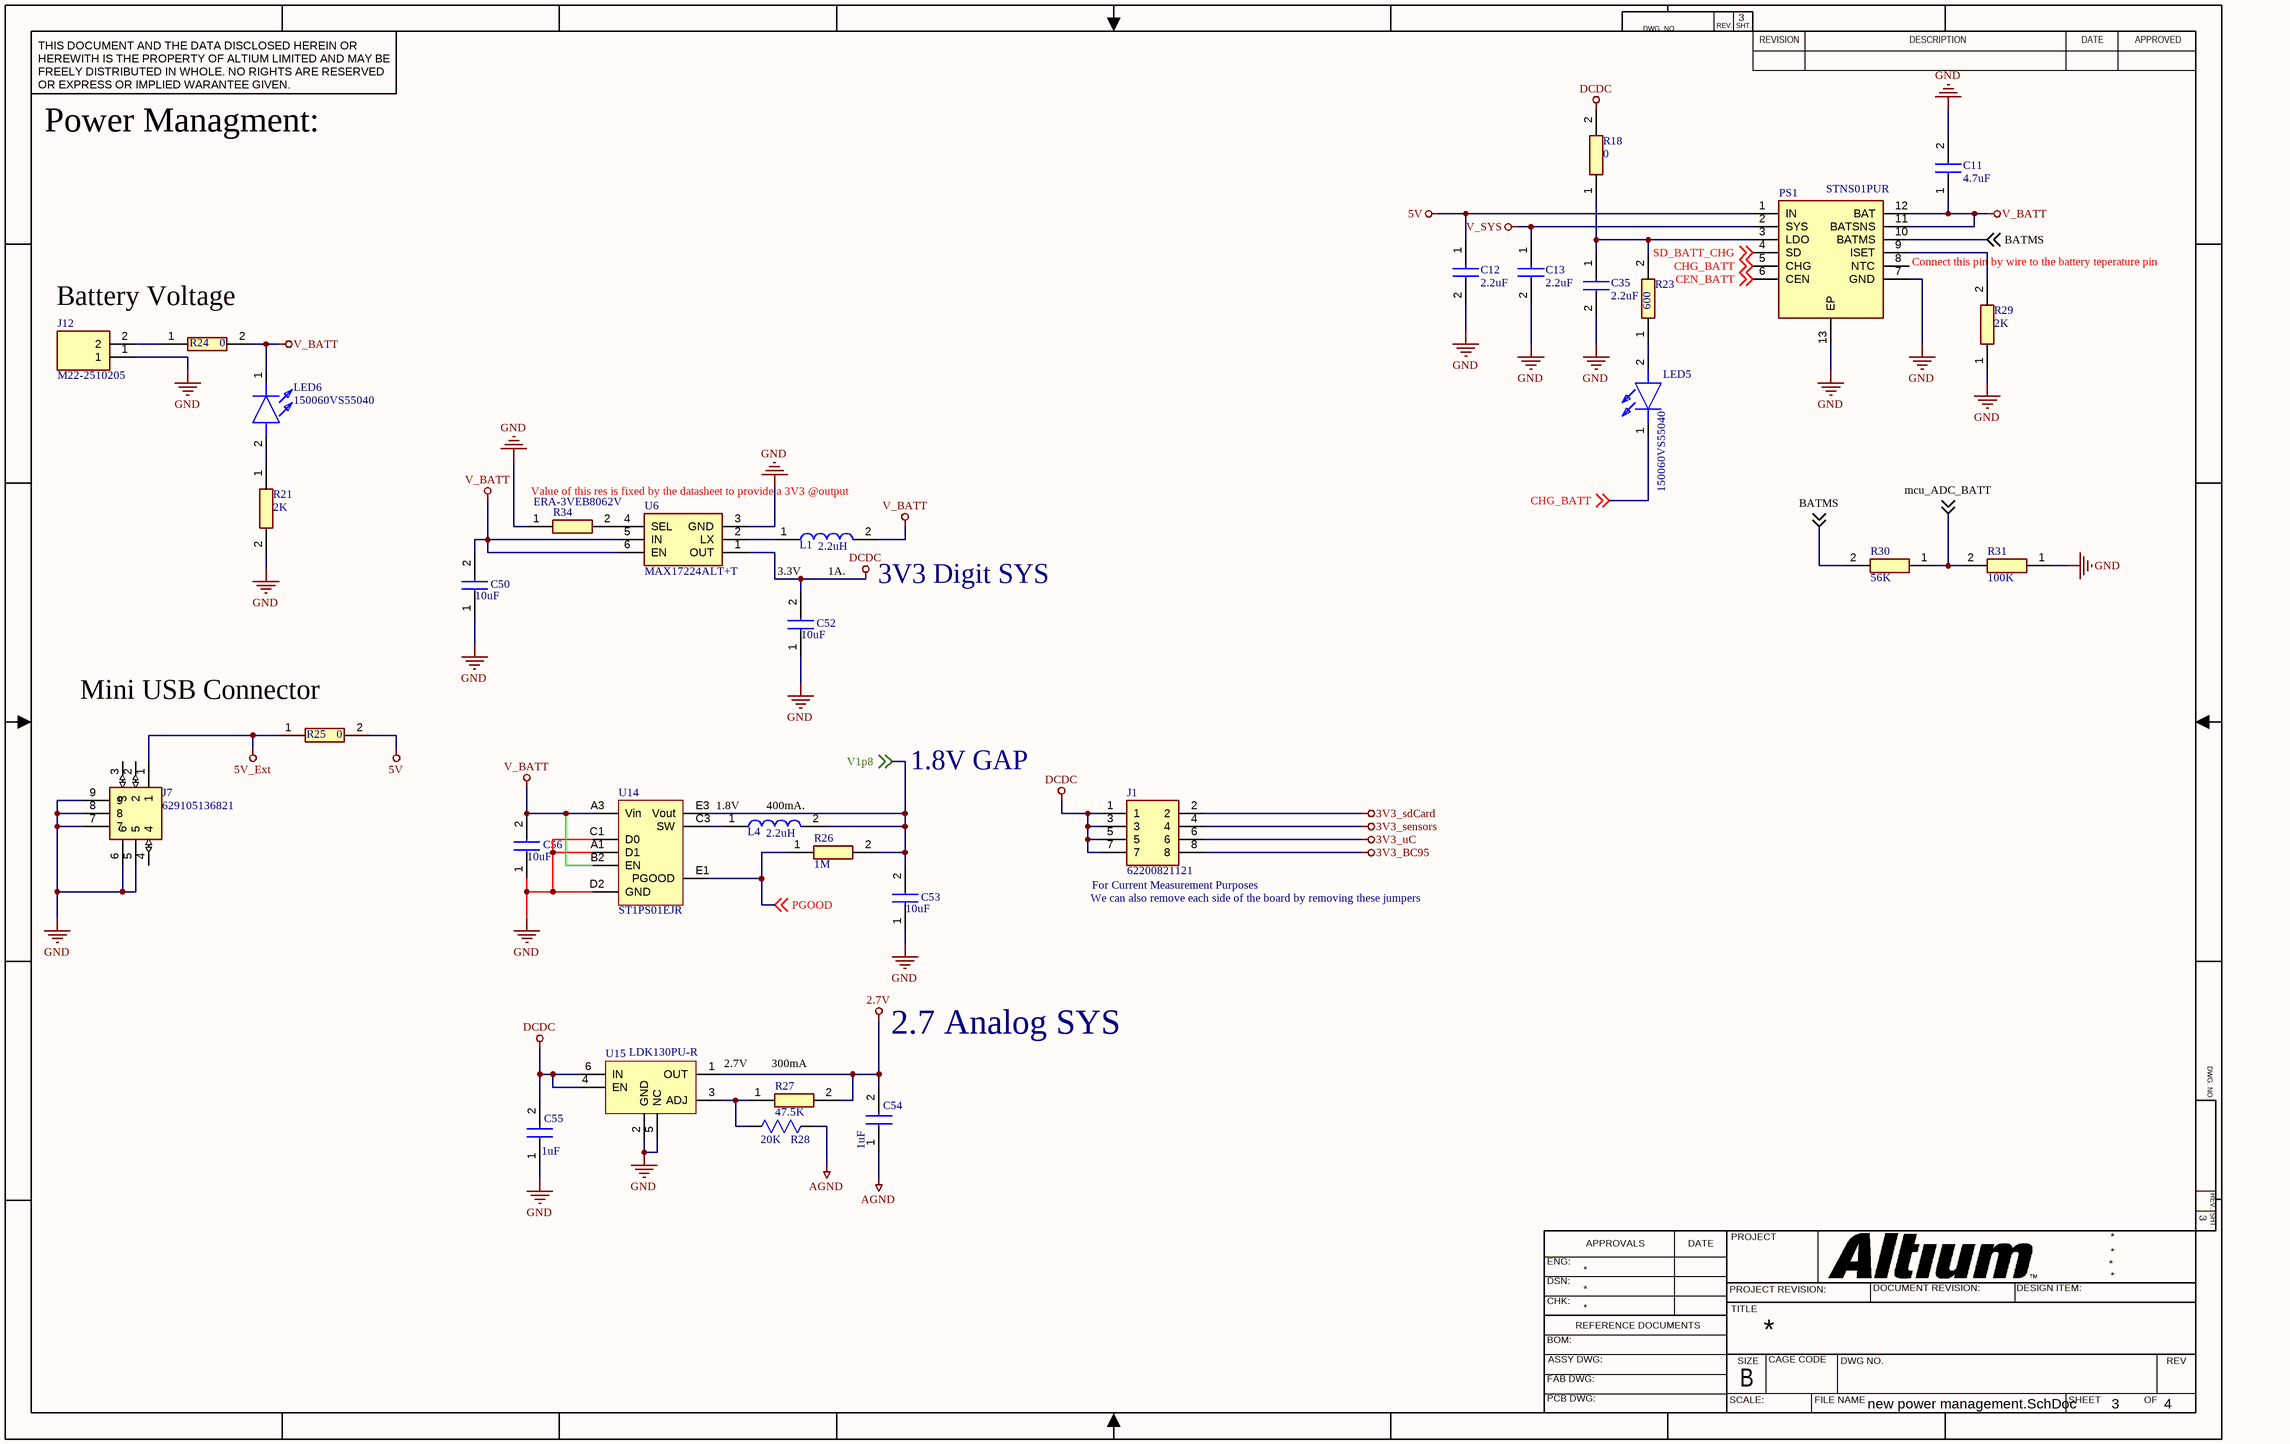
[diagram p2: new power management.SchDoc]

### Parts
C11  4.7uF  [CAPC1608X90N]
C12  2.2uF  [CAPC1608X90N]
C13  2.2uF  [CAPC1608X90N]
C35  2.2uF  [CAPC1608X90N]
C50  10uF  [CAPC1005X90N]
C52  10uF  [CAPC1005X90N]
C53  10uF  [CAPC1005X90N]
C54  1uF  [CAPC1005X55N]
C55  1uF  [CAPC1005X55N]
C56  10uF  [CAPC1005X90N]
J1  62200821121  [HDRV8W50P127_2X4_508X340X530P]
J7  629105136821  [MICRO-USB(2.0-SMT-TYPE-B)]
J12  M22-2510205  [HDRV2W60P0X200_1X2_400X200X525P]
L1  2.2uH  [INDC2520X100N]
L4  2.2uH  [INDC2520X100N]
LED5  150060VS55040  [LEDM168X50N]
LED6  150060VS55040  [LEDM168X50N]
PS1  STNS01PUR  [SON45P300X300X80-13N-D]
R18  0  [RESC1608X55N]
R21  2K  [RESC1005X35N]
R23  600  [RESC2012X60N]
R24  0  [RESC1608X55N]
R25  0  [RESC1608X55N]
R26  1M  [RESC1005X40N]
R27  47.5K  [RESC1005X40N]
R28  20K  [RESC1005X40N]
R29  2K  [RESC1608X55N]
R30  56K  [ERA3KV_(0603)]
R31  100K  [RESC1608X55N]
R34  ERA-3VEB8062V  [ERA3KV_(0603)]
U6  MAX17224ALT+T  [MAX17220ALT]
U14  ST1PS01EJR  [ST1PS01EJR]
U15  LDK130PU-R  [LDK130PU18R]

### Nets
2.7V: C54.2 R27.2 U15.1(OUT)
3V3_BC95: J1.8
3V3_sdCard: J1.2
3V3_sensors: J1.4
3V3_uC: J1.6
5V: C12.1 PS1.1(IN) R25.2
5V_Ext: J7.1 R25.1
AGND: C54.1 R28.1(R1)
DCDC: C52.2 C55.2 J1.1 J1.3 J1.5 J1.7 R18.2 U6.1(OUT) U15.4(EN) U15.6(IN)
GND: C11.2 C12.2 C13.2 C35.2 C50.1 C52.1 C53.1 C55.1 C56.1 J7.5 J7.6 J7.7 J7.8 J7.9 J12.1 PS1.7(GND) PS1.13(EP) R21.2 R29.1 R31.1 R34.1 U6.3(GND) U14.A1(D1) U14.C1(D0) U14.D2(GND) U15.2(GND) U15.5(NC)
V_BATT: C11.1 C50.2 C56.2 L1.2 LED6.1(K) PS1.11(BATSNS) PS1.12(BAT) R24.2 U6.5(IN) U6.6(EN) U14.A3(Vin) U14.B2(EN)
V_SYS: C13.1 PS1.2(SYS)
BATMS: PS1.10(BATMS) R30.2 ; off-sheet BATMS
CEN_BATT: PS1.6(CEN) ; off-sheet CEN_BATT
CHG_BATT: LED5.1(K) PS1.5(CHG) ; off-sheet CHG_BATT
mcu_ADC_BATT: R30.1 R31.2 ; off-sheet mcu_ADC_BATT
PGOOD: R26.1 U14.E1(PGOOD) ; off-sheet PGOOD
SD_BATT_CHG: PS1.4(SD) ; off-sheet SD_BATT_CHG
V1p8: C53.2 L4.2 R26.2 U14.E3(Vout) ; off-sheet V1p8
NetC35_1: C35.1 PS1.3(LDO) R18.1 R23.2
NetJ12_2: J12.2 R24.1
NetL1_1: L1.1 U6.2(LX)
NetL4_1: L4.1 U14.C3(SW)
NetLED5_2: LED5.2(A) R23.1
NetLED6_2: LED6.2(A) R21.1
NetPS1_9: PS1.9(ISET) R29.2
NetR27_1: R27.1 R28.2(R2) U15.3(ADJ)
NetR34_2: R34.2 U6.4(SEL)

Not connected (* = marked no-connect by the designer): J7 2 3 4; PS1 8(NTC)

### Notes on the sheet
- Power Managment:
- Connect this pin by wire to the battery teperature pin
- Battery Voltage
- Value of this res is fixed by the datasheet to provide a 3V3 @output
- 3.3V         1A.
- (near L1) 3V3 Digit SYS
- (near R25) Mini USB Connector
- (near L4) 1.8V         400mA.
- 1.8V GAP
- (near J1) We can also remove each side of the board by removing these jumpers
- (near J1) For Current Measurement Purposes
- 2.7V        300mA
- 2.7 Analog SYS
- DWG. NO.
- REV.
- SHT.
- THIS DOCUMENT AND THE DATA DISCLOSED HEREIN OR HEREWITH IS THE PROPERTY OF ALTIUM LIMITED AND MAY BE FREELY DISTRIBUTED IN WHOLE. NO RIGHTS ARE RESERVED OR EXPRESS OR IMPLIED WARANTEE GIVEN.
- REVISION
- DESCRIPTION
- DATE
- APPROVED
- ENG:
- APPROVALS
- PROJECT
- DSN:
- CHK:
- REFERENCE DOCUMENTS
- PROJECT REVISION:
- TITLE
- DOCUMENT REVISION:
- DESIGN ITEM:
- BOM:
- FAB DWG:
- PCB DWG:
- ASSY DWG:
- SCALE:
- SIZE
- B
- CAGE CODE
- FILE NAME
- DWG NO.
- SHEET
- OF
- REV

### Library data of the parts
C11 = LMK107BJ475KA-T: Capacitor; Manufacturer_Name: TAIYO YUDEN; Height: 0.9mm; Manufacturer_Part_Number: LMK107BJ475KA-T
C12 C13 C35 = GRM188R71A225KE15D: Capacitor; Manufacturer_Name: Murata Electronics; Datasheet Link: https://psearch.en.murata.com/capacitor/product/GRM188R71A225KE15%23.html; Height: 0.9mm; Manufacturer_Part_Number: GRM188R71A225KE15D
C50 C52 C53 C56 = CL05A106MP8NUB8: Capacitor; Manufacturer_Name: Samsung Electro-Mechanics; Datasheet Link: https://datasheet.datasheetarchive.com/originals/distributors/DKDS-19/372904.pdf; Height: 0.9mm; Manufacturer_Part_Number: CL05A106MP8NUB8
C54 C55 = JMK105BJ105KV-F: Capacitor; Manufacturer_Name: TAIYO YUDEN; Datasheet Link: https://datasheet.datasheetarchive.com/originals/distributors/Datasheets-DGA20/25674.pdf; Height: 0.55mm; Manufacturer_Part_Number: JMK105BJ105KV-F
J1 = 62200821121: Connector; Manufacturer_Name: Wurth Elektronik; Height: 5.3mm; Manufacturer_Part_Number: 62200821121
J7 = 629105136821: Connector; Manufacturer_Name: Wurth Elektronik; Datasheet Link: https://componentsearchengine.com/Datasheets/1/629105136821.pdf; Mouser2 Part Number: 710-629105136821; Mouser2 Price/Stock: https://www.mouser.com/Search/Refine.aspx?Keyword=710-629105136821; Manufacturer_Part_Number: 629105136821
J12 = M22-2510205: Connector; Manufacturer_Name: Harwin; Datasheet Link: https://cdn.harwin.com/pdfs/M22-251.pdf; Height: 5.25mm; Manufacturer_Part_Number: M22-2510205
L1 L4 = 74438323022: Inductor; Manufacturer_Name: Wurth Elektronik; Datasheet Link: https://componentsearchengine.com//74438323022.pdf; Height: 1mm; Mouser2 Part Number: 710-74438323022; Mouser2 Price/Stock: https://www.mouser.com/Search/Refine.aspx?Keyword=710-74438323022; Manufacturer_Part_Number: 74438323022
LED5 LED6 = 150060VS55040: LED; Manufacturer_Name: Wurth Elektronik; Datasheet Link: https://katalog.we-online.com/led/datasheet/150060VS55040.pdf; Height: 0.5mm; Manufacturer_Part_Number: 150060VS55040
PS1 = STNS01PUR: Power Supply; Manufacturer_Name: STMicroelectronics; Datasheet Link: https://componentsearchengine.com/Datasheets/2/STNS01PUR.pdf; Height: 0.8mm; Manufacturer_Part_Number: STNS01PUR
R18 R24 R25 = RC0603FR-070RL: as R1 on sheet mems; Height: 0.55mm; Manufacturer_Part_Number: RC0603FR-070RL
R21 = RT0402FRE072KL: Resistor; Manufacturer_Name: YAGEO (PHYCOMP); Datasheet Link: https://datasheet.datasheetarchive.com/originals/distributors/Datasheets_SAMA/a1f8f48f216d234b3e6a96d43a77a0c1.pdf; Height: 0.35mm; Manufacturer_Part_Number: RT0402FRE072KL
R23 = CRCW0805600RFKEAHP: Resistor; Manufacturer_Name: Vishay; Datasheet Link: https://componentsearchengine.com/Datasheets/1/CRCW08051R00FKEAHP.pdf; Height: 0.6mm; Manufacturer_Part_Number: CRCW0805600RFKEAHP
R26 = CRG0402F1M0: Resistor; Manufacturer_Name: TE Connectivity; Datasheet Link: https://datasheet.datasheetarchive.com/originals/distributors/DKDS-21/401698.pdf; Height: 0.4mm; Manufacturer_Part_Number: CRG0402F1M0
R27 = RC0402FR-0747K5L: Resistor; Manufacturer_Name: YAGEO (PHYCOMP); Datasheet Link: https://componentsearchengine.com//RC0402FR-0747K5L.pdf; Height: 0.4mm; Mouser2 Part Number: 603-RC0402FR-0747K5L; Mouser2 Price/Stock: https://www.mouser.com/Search/Refine.aspx?Keyword=603-RC0402FR-0747K5L; Manufacturer_Part_Number: RC0402FR-0747K5L
R28 = RC0402FR-0720KL: 20 kOhms Â±1% 0.063W, 1/16W Chip Resistor 0402 _1005 Metric_ Moisture Resistant Thick Film; MF: Yageo; MP: RC0402FR-0720KL; Package: 0402 Yageo; SnapEDA_Link: https://www.snapeda.com/parts/RC0402FR-0720KL/Yageo/view-part/614868/?ref=snap; Availability: Unavailable; Price: None; Value: *
R29 = CPF0603F2K0C1: Resistor; Manufacturer_Name: TE Connectivity; Height: 0.55mm; Manufacturer_Part_Number: CPF0603F2K0C1
R30 = ERA-3VRW5602V: Resistor; Manufacturer_Name: Panasonic; Datasheet Link: http://industrial.panasonic.com/cdbs/www-data/pdf/RDM0000/RDM0000C331.pdf; Height: 0.4mm; Manufacturer_Part_Number: ERA-3VRW5602V
R31 = CHV0603AFX-1003ELF: Resistor; Manufacturer_Name: Bourns; Datasheet Link: https://www.bourns.com/docs/product-datasheets/chv.pdf?sfvrsn=adcf1bf9_27; Height: 0.55mm; Manufacturer_Part_Number: CHV0603AFX-1003ELF
R34 = ERA-3VEB8062V: Resistor; Manufacturer_Name: Panasonic; Datasheet Link: http://industrial.panasonic.com/cdbs/www-data/pdf/RDM0000/RDM0000C331.pdf; Height: 0.4mm; Manufacturer_Part_Number: ERA-3VEB8062V
U6 = MAX17224ALT+T: Inductor; Manufacturer_Name: Maxim Integrated; Datasheet Link: https://datasheets.maximintegrated.com/en/ds/MAX17220-MAX17225.pdf; Height: 0.8mm; Manufacturer_Part_Number: MAX17224ALT+T
U14 = ST1PS01EJR: 400mA Nano-Quiescent Synchronous step-down converter with digital voltage select; Manufacturer: STMicroelectronics; Output Type: Fixed; Output Configuration: Positive; Number of Outputs: 1; Min Input Voltage: 1.8V; Max Input Voltage: 5.5V; Min Output Voltage: 3.3V; Switching Frequency: 2MHz; Synchronous Rectifier: Yes; Supplier 1: RSComponents; Supplier Part Number 1: 1924839; Manufacturer Part Number: ST1PS01EJR; RoHS: Yes; Category: Voltage Regulators - Switching; Stock 1: 500; Mount: Surface Mount; Min Operating Temperature: -40°C; Max Operating Temperature: 85°C; Packaging: Tape and Reel; Output Current: 400mA; RoHS Compliant: Yes; ComponentLink1URL: https://www.st.com/resource/en/datasheet/st1ps01.pdf?src-supplier=Digi-Key; ComponentLink1Description: https://www.st.com/resource/en/datasheet/st1ps01.pdf?src-supplier=Digi-Key
U15 = LDK130PU-R: Adjustable Positive LDO Regulator, 0.8V Min, 5.1V Max, 0.4V Dropout, PDSO6; Manufacturer: STMicroelectronics; Number of Outputs: 1; Min Input Voltage: 1.9V; Output Current: 300mA; Max Input Voltage: 5.5V; Dropout Voltage: 200mV; Output Voltage: 5.3V; Quiescent Current: 60uA; Min Output Voltage: 800mV; Accuracy: 2%; Operating Supply Current: 70uA; Power Supply Rejection Ratio (PSRR): 55dB; Supplier 1: Mouser; Supplier Part Number 1: 511-LDK130PU-R; Manufacturer Part Number: LDK130PU-R; RoHS: Yes; Category: Voltage Regulators - Linear; Stock 1: 232; Mount: Surface Mount; Case/Package: DFN; Number of Pins: 6; Min Operating Temperature: -40°C; Max Operating Temperature: 125°C; Packaging: Tape and Reel; Max Output Current: 300mA; Package Quantity: 3000; Number of Regulators: 1; Polarity: Positive; Output Voltage Accuracy: 2%; Tolerance: 2%; Output Type: Adjustable; Length: 1.3mm; Width: 1.2mm; Height: 0.45mm; Radiation Hardening: No; REACH SVHC: No SVHC; Lead Free: Lead Free; RoHS Compliant: Yes; ComponentLink1URL: https://datasheet.ciiva.com/30007/dm00076097-30007047.pdf?src-supplier=Avnet; ComponentLink1Description: https://datasheet.ciiva.com/30007/dm00076097-30007047.pdf?src-supplier=Avnet; ComponentLink2URL: https://datasheet.ciiva.com/29568/dm00076097-29568344.pdf?src-supplier=Digi-Key; ComponentLink2Description: https://datasheet.ciiva.com/29568/dm00076097-29568344.pdf?src-supplier=Digi-Key; ComponentLink3URL: https://datasheet.ciiva.com/29568/dm00076097-29568345.pdf?src-supplier=Digi-Key; ComponentLink3Description: https://datasheet.ciiva.com/29568/dm00076097-29568345.pdf?src-supplier=Digi-Key; ComponentLink4URL: https://datasheet.ciiva.com/29568/dm00076097-29568346.pdf?src-supplier=Digi-Key; ComponentLink4Description: https://datasheet.ciiva.com/29568/dm00076097-29568346.pdf?src-supplier=Digi-Key